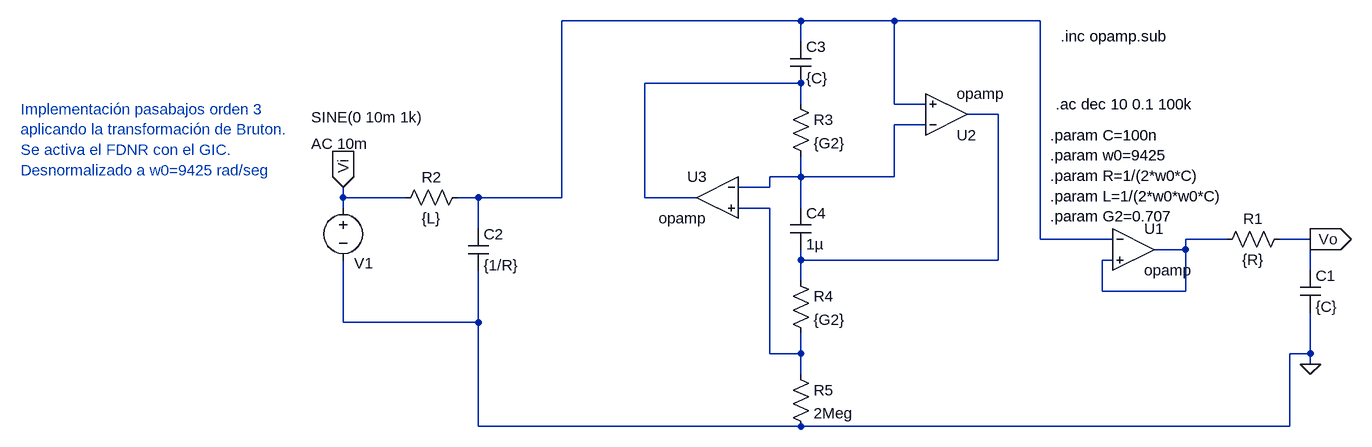
[diagram p0: schematic pasabajos_gicasc.asc]
pasabajos_gicasc.asc, the LTspice schematic file:
Version 4
SHEET 1 1044 680
WIRE 96 -112 -272 -112
WIRE 240 -112 96 -112
WIRE 464 -112 240 -112
WIRE 96 -80 96 -112
WIRE 96 -16 -144 -16
WIRE 96 16 96 -16
WIRE 240 16 240 -112
WIRE 288 16 240 16
WIRE 400 32 352 32
WIRE 288 48 240 48
WIRE 96 128 96 96
WIRE 96 128 48 128
WIRE 240 128 240 48
WIRE 240 128 96 128
WIRE 48 144 48 128
WIRE 48 144 0 144
WIRE -608 160 -608 144
WIRE -512 160 -608 160
WIRE -400 160 -432 160
WIRE -272 160 -272 -112
WIRE -272 160 -400 160
WIRE -144 160 -144 -16
WIRE -64 160 -144 160
WIRE -608 176 -608 160
WIRE 48 176 0 176
WIRE 96 176 96 128
WIRE -400 208 -400 160
WIRE 464 224 464 -112
WIRE 576 224 464 224
WIRE 752 224 688 224
WIRE 880 224 832 224
WIRE 688 240 688 224
WIRE 688 240 640 240
WIRE 96 256 96 240
WIRE 400 256 400 32
WIRE 400 256 96 256
WIRE 576 256 560 256
WIRE 880 272 880 224
WIRE 96 288 96 256
WIRE 560 304 560 256
WIRE 688 304 688 240
WIRE 688 304 560 304
WIRE -608 352 -608 256
WIRE -400 352 -400 272
WIRE -400 352 -608 352
WIRE 48 400 48 176
WIRE 96 400 96 368
WIRE 96 400 48 400
WIRE 880 400 880 336
WIRE 880 400 848 400
WIRE 880 416 880 400
WIRE 96 432 96 400
WIRE -400 512 -400 352
WIRE 96 512 -400 512
WIRE 848 512 848 400
WIRE 848 512 96 512
FLAG 880 224 Vo
IOPIN 880 224 Out
FLAG -608 144 Vi
IOPIN -608 144 In
FLAG 880 416 0
SYMBOL res 848 208 R90
WINDOW 0 0 56 VBottom 2
WINDOW 3 32 56 VTop 2
SYMATTR InstName R1
SYMATTR Value {R}
SYMBOL cap 864 272 R0
SYMATTR InstName C1
SYMATTR Value {C}
SYMBOL OpAmps\\opamp 608 176 R0
SYMATTR InstName U1
SYMBOL voltage -608 160 R0
WINDOW 3 -49 -124 Left 2
WINDOW 123 -49 -83 Left 2
WINDOW 39 0 0 Left 0
WINDOW 0 17 101 Left 2
SYMATTR Value SINE(0 10m 1k)
SYMATTR Value2 AC 10m
SYMATTR InstName V1
SYMBOL res -416 144 R90
WINDOW 0 0 56 VBottom 2
WINDOW 3 32 56 VTop 2
SYMATTR InstName R2
SYMATTR Value {L}
SYMBOL cap -416 208 R0
SYMATTR InstName C2
SYMATTR Value {1/R}
SYMBOL cap 80 -80 R0
SYMATTR InstName C3
SYMATTR Value {C}
SYMBOL res 80 0 R0
SYMATTR InstName R3
SYMATTR Value {G2}
SYMBOL cap 80 176 R0
SYMATTR InstName C4
SYMATTR Value 1µ
SYMBOL res 80 272 R0
SYMATTR InstName R4
SYMATTR Value {G2}
SYMBOL res 80 416 R0
SYMATTR InstName R5
SYMATTR Value 2Meg
SYMBOL OpAmps\\opamp 320 96 M180
SYMATTR InstName U2
SYMBOL OpAmps\\opamp -32 96 M0
SYMATTR InstName U3
TEXT 480 64 Left 2 !.param C=100n\n.param w0=9425\n.param R=1/(2*w0*C)\n.param L=1/(2*w0*w0*C)\n.param G2=0.707
TEXT 488 16 Left 2 !.ac dec 10 0.1 100k
TEXT 496 -88 Left 2 !.inc opamp.sub
TEXT -1104 24 Left 2 ;Implementación pasabajos orden 3 \naplicando la transformación de Bruton.\nSe activa el FDNR con el GIC.\nDesnormalizado a w0=9425 rad/seg

The netlist it stands for:
* pasabajos_gicasc.asc
R1 Vo N006 {R}
C1 Vo 0 {C}
XU1 N001 N006 N006 opamp Aol=100K GBW=10Meg  ; pins invin noninvin out
V1 Vi 0 SINE(0 10m 1k) AC 10m
R2 N001 Vi {L}
C2 N001 0 {1/R}
C3 N001 N002 {C}
R3 N002 N004 {G2}
C4 N004 N003 1µ
R4 N003 N005 {G2}
R5 N005 0 2Meg
XU2 N004 N001 N003 opamp Aol=100K GBW=10Meg  ; pins invin noninvin out
XU3 N004 N005 N002 opamp Aol=100K GBW=10Meg  ; pins invin noninvin out
.param C=100n
.param w0=9425
.param R=1/(2*w0*C)
.param L=1/(2*w0*w0*C)
.param G2=0.707
.ac dec 10 0.1 100k
.inc opamp.sub
* Implementación pasabajos orden 3
* aplicando la transformación de Bruton.
* Se activa el FDNR con el GIC.
* Desnormalizado a w0=9425 rad/seg
.backanno
.end